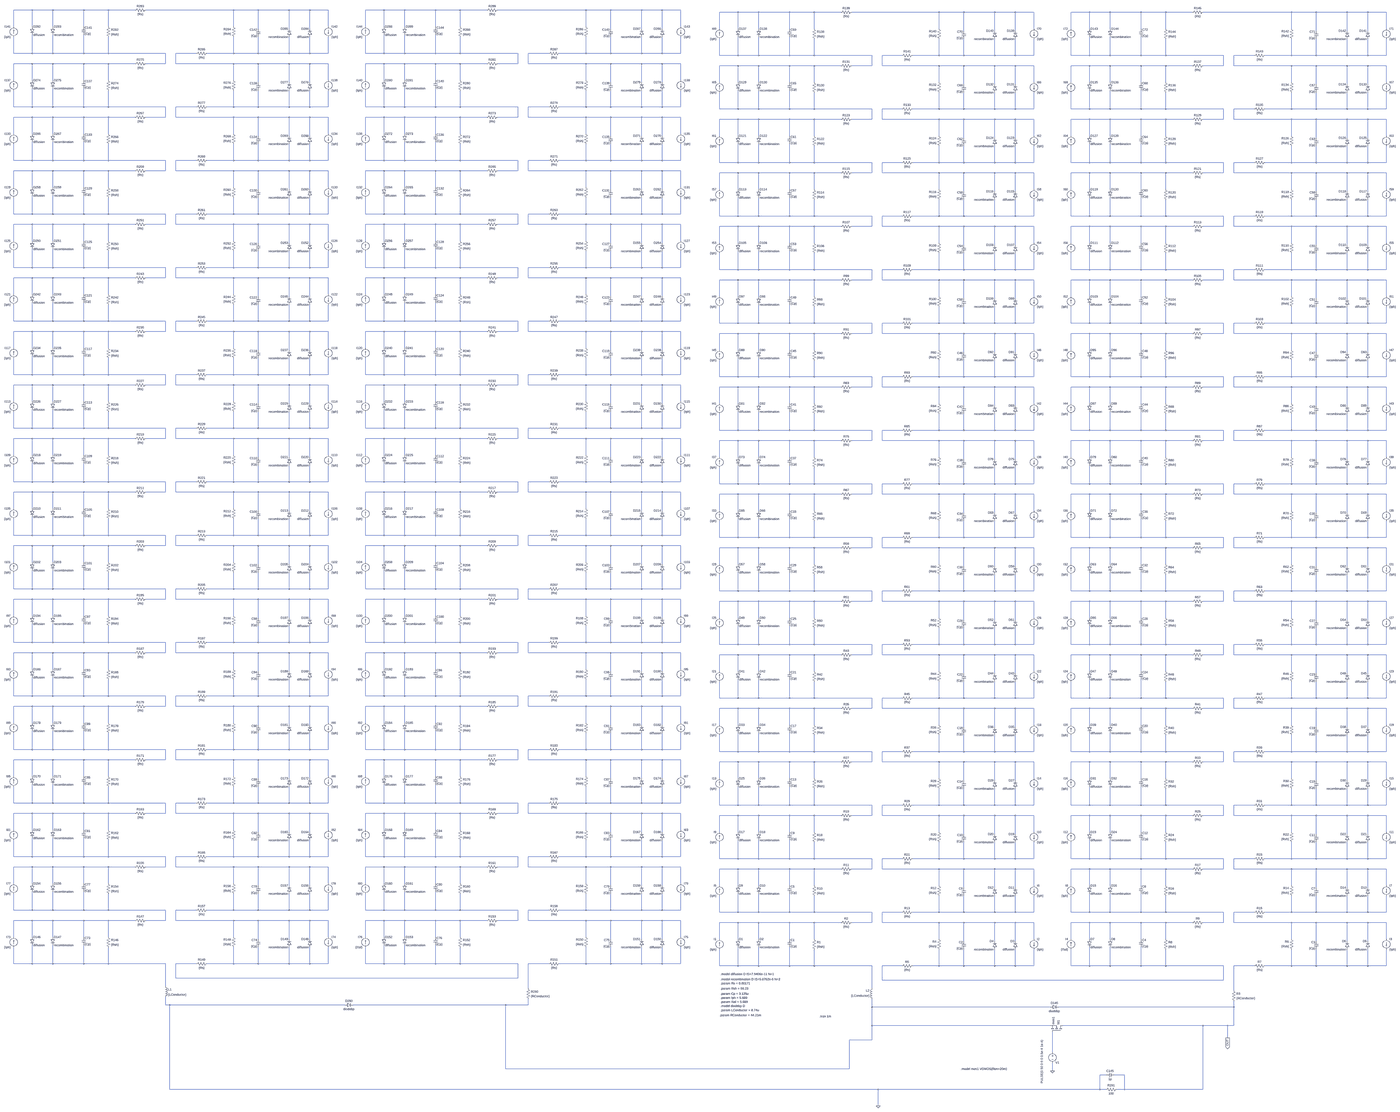
[diagram p0: schematic shortcircuit-cells.asc, whole sheet]
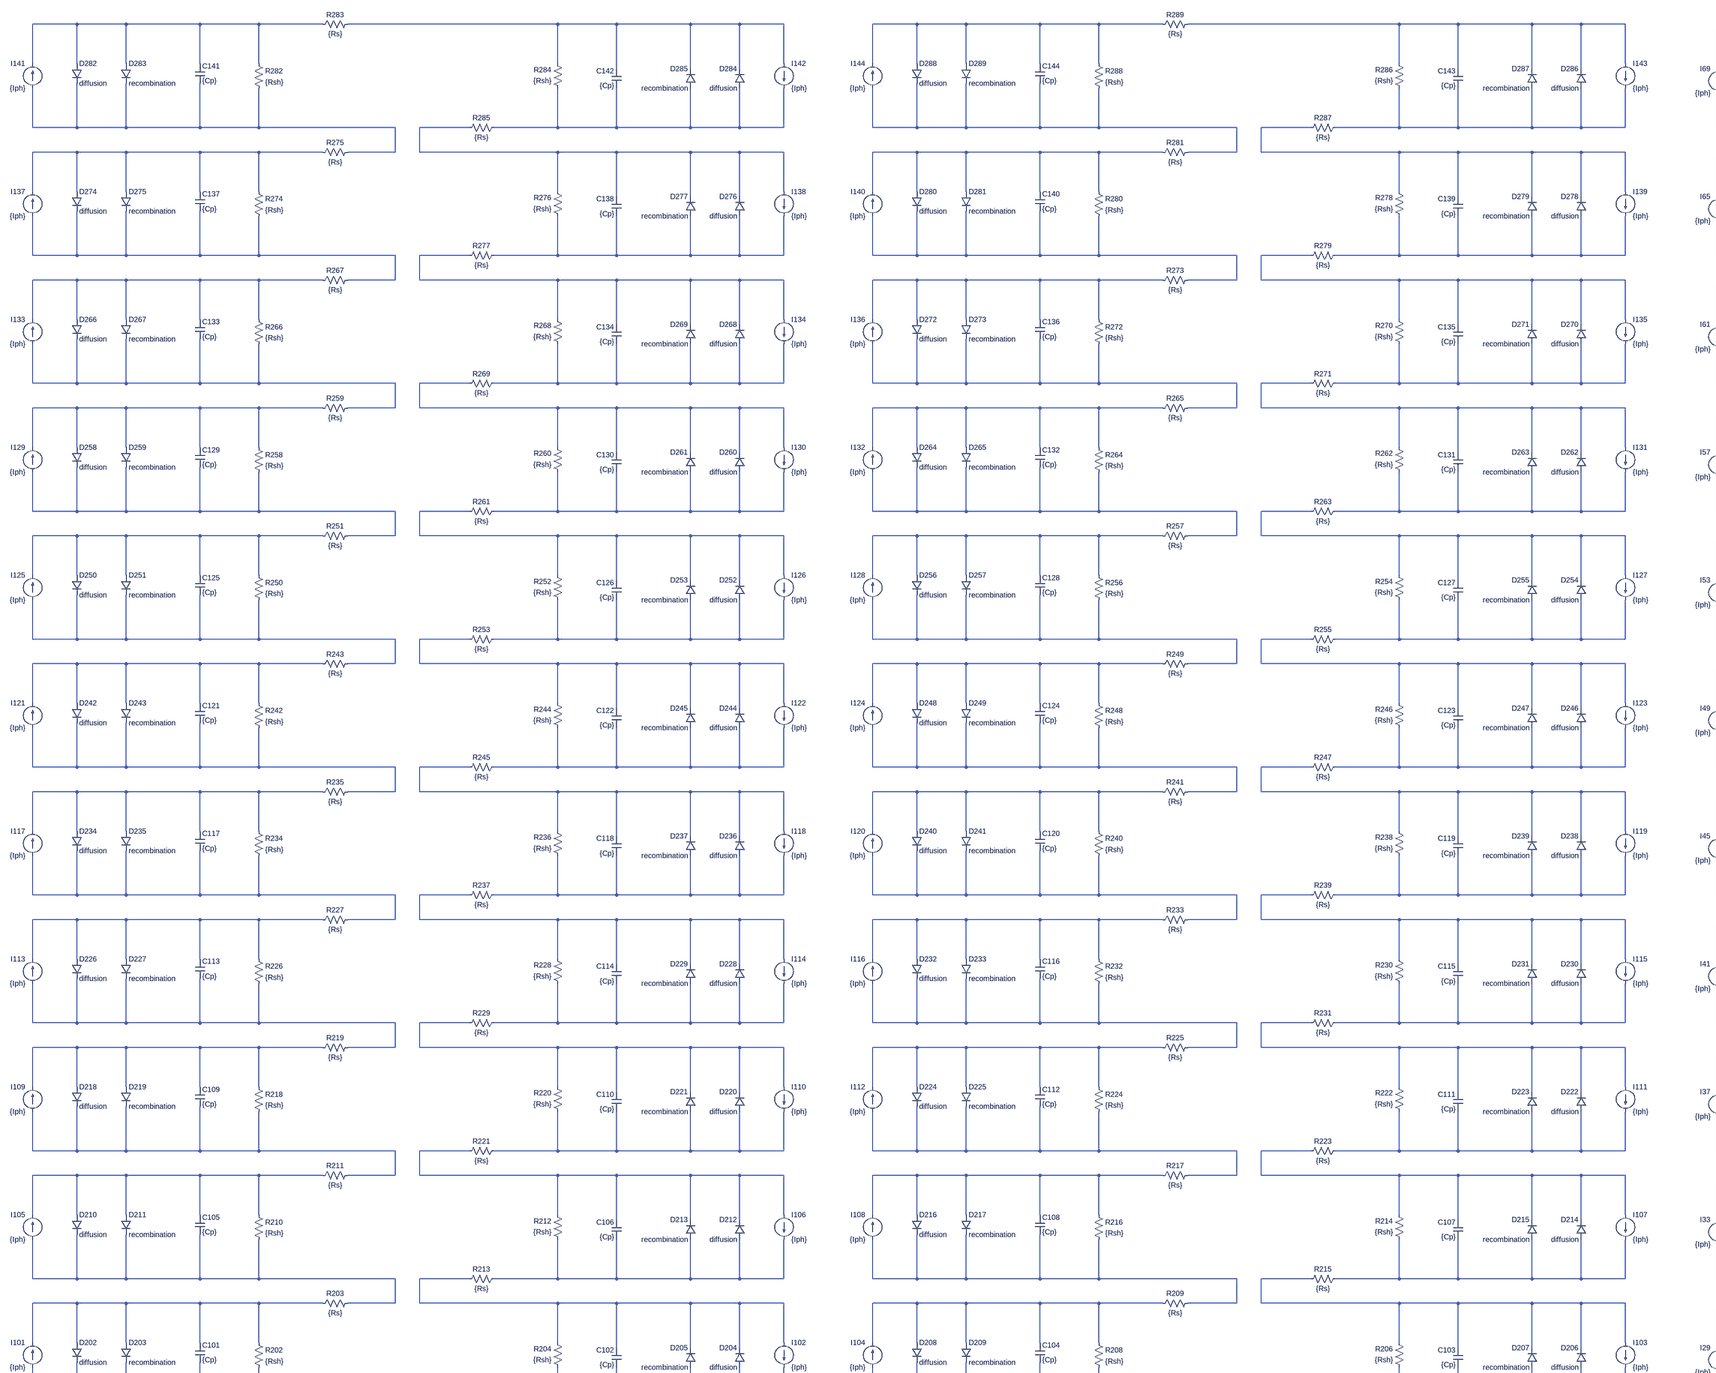
[diagram p1: schematic shortcircuit-cells.asc, part, row 1 of 2, column 1 of 2]
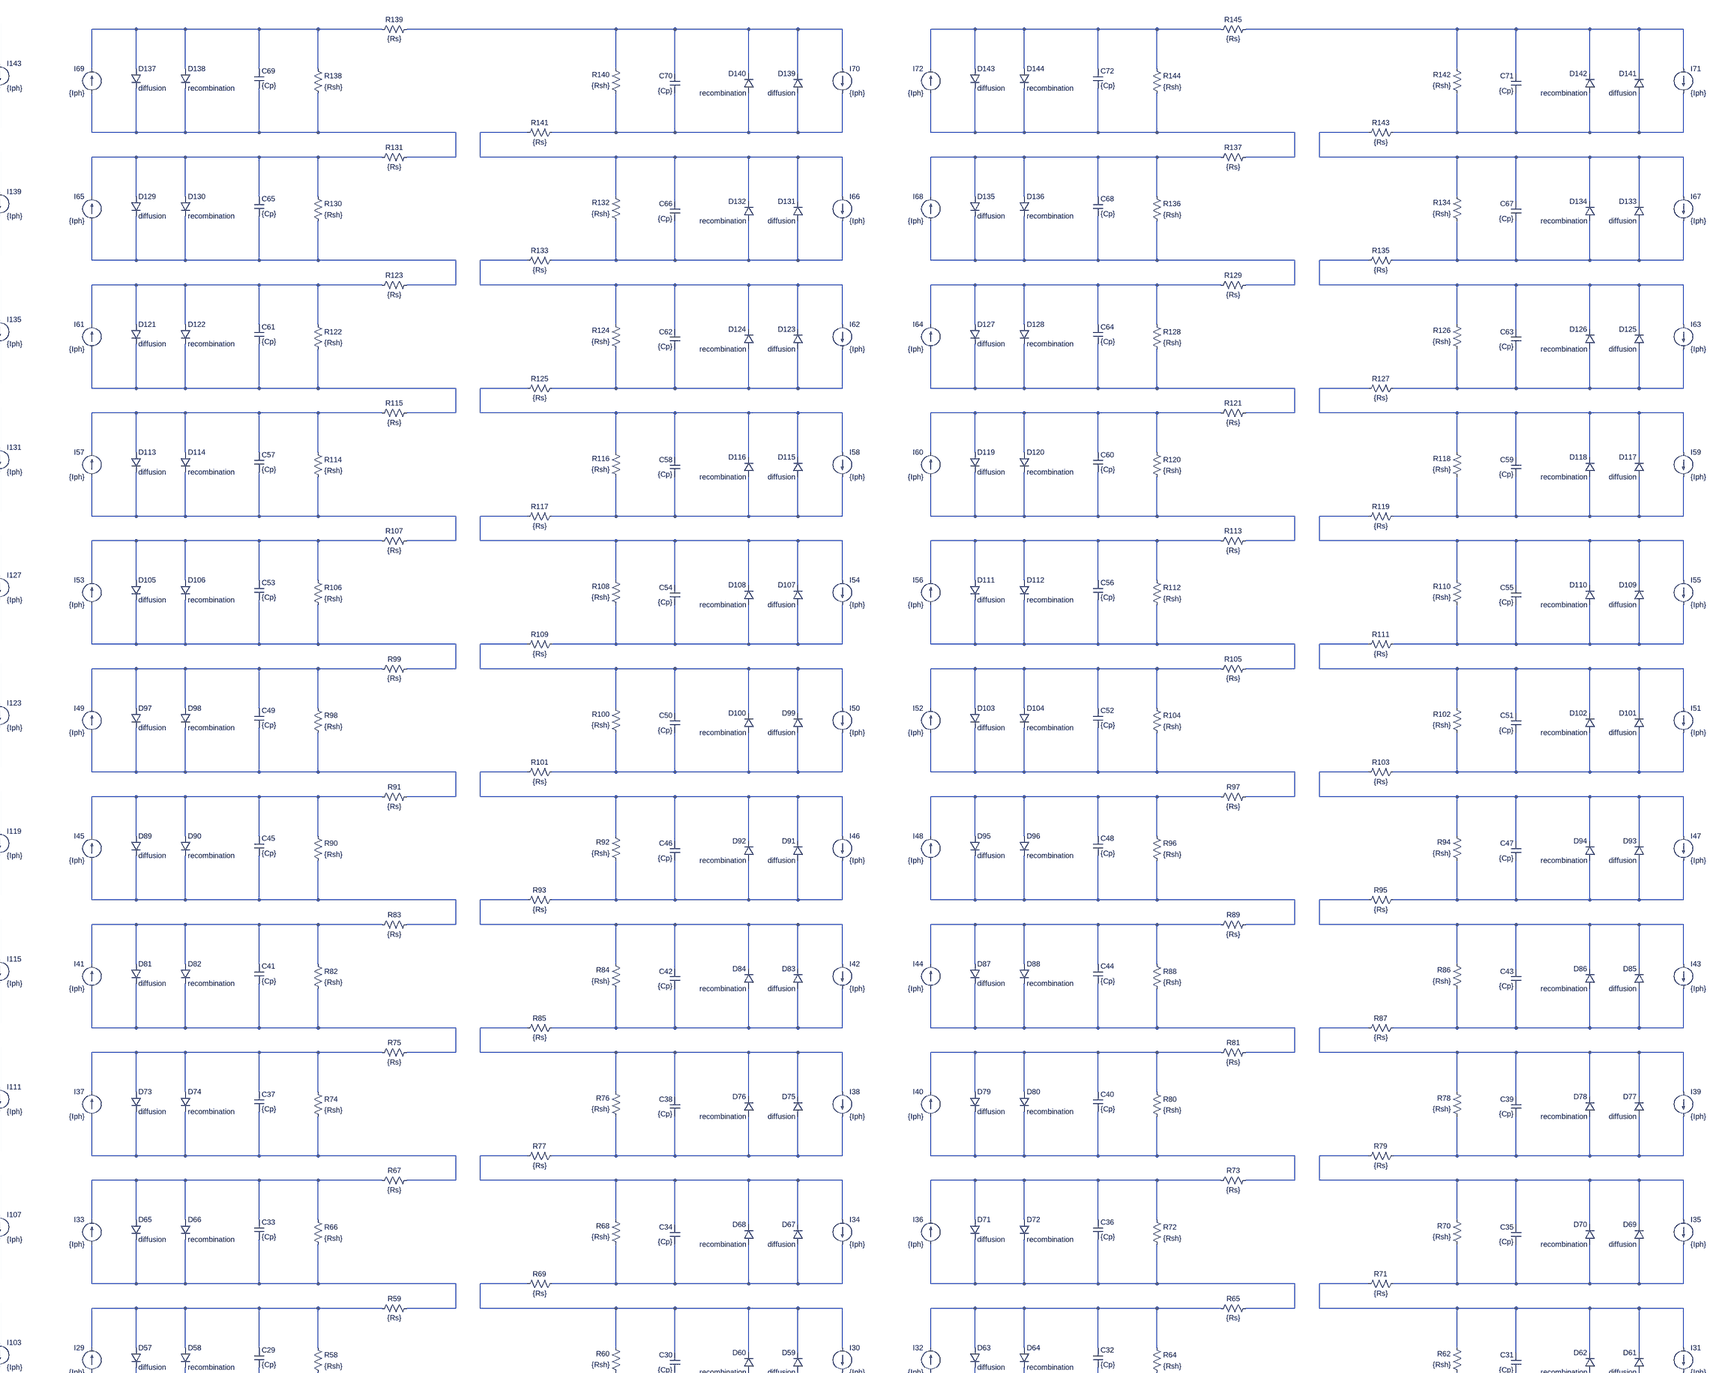
[diagram p2: schematic shortcircuit-cells.asc, part, row 1 of 2, column 2 of 2]
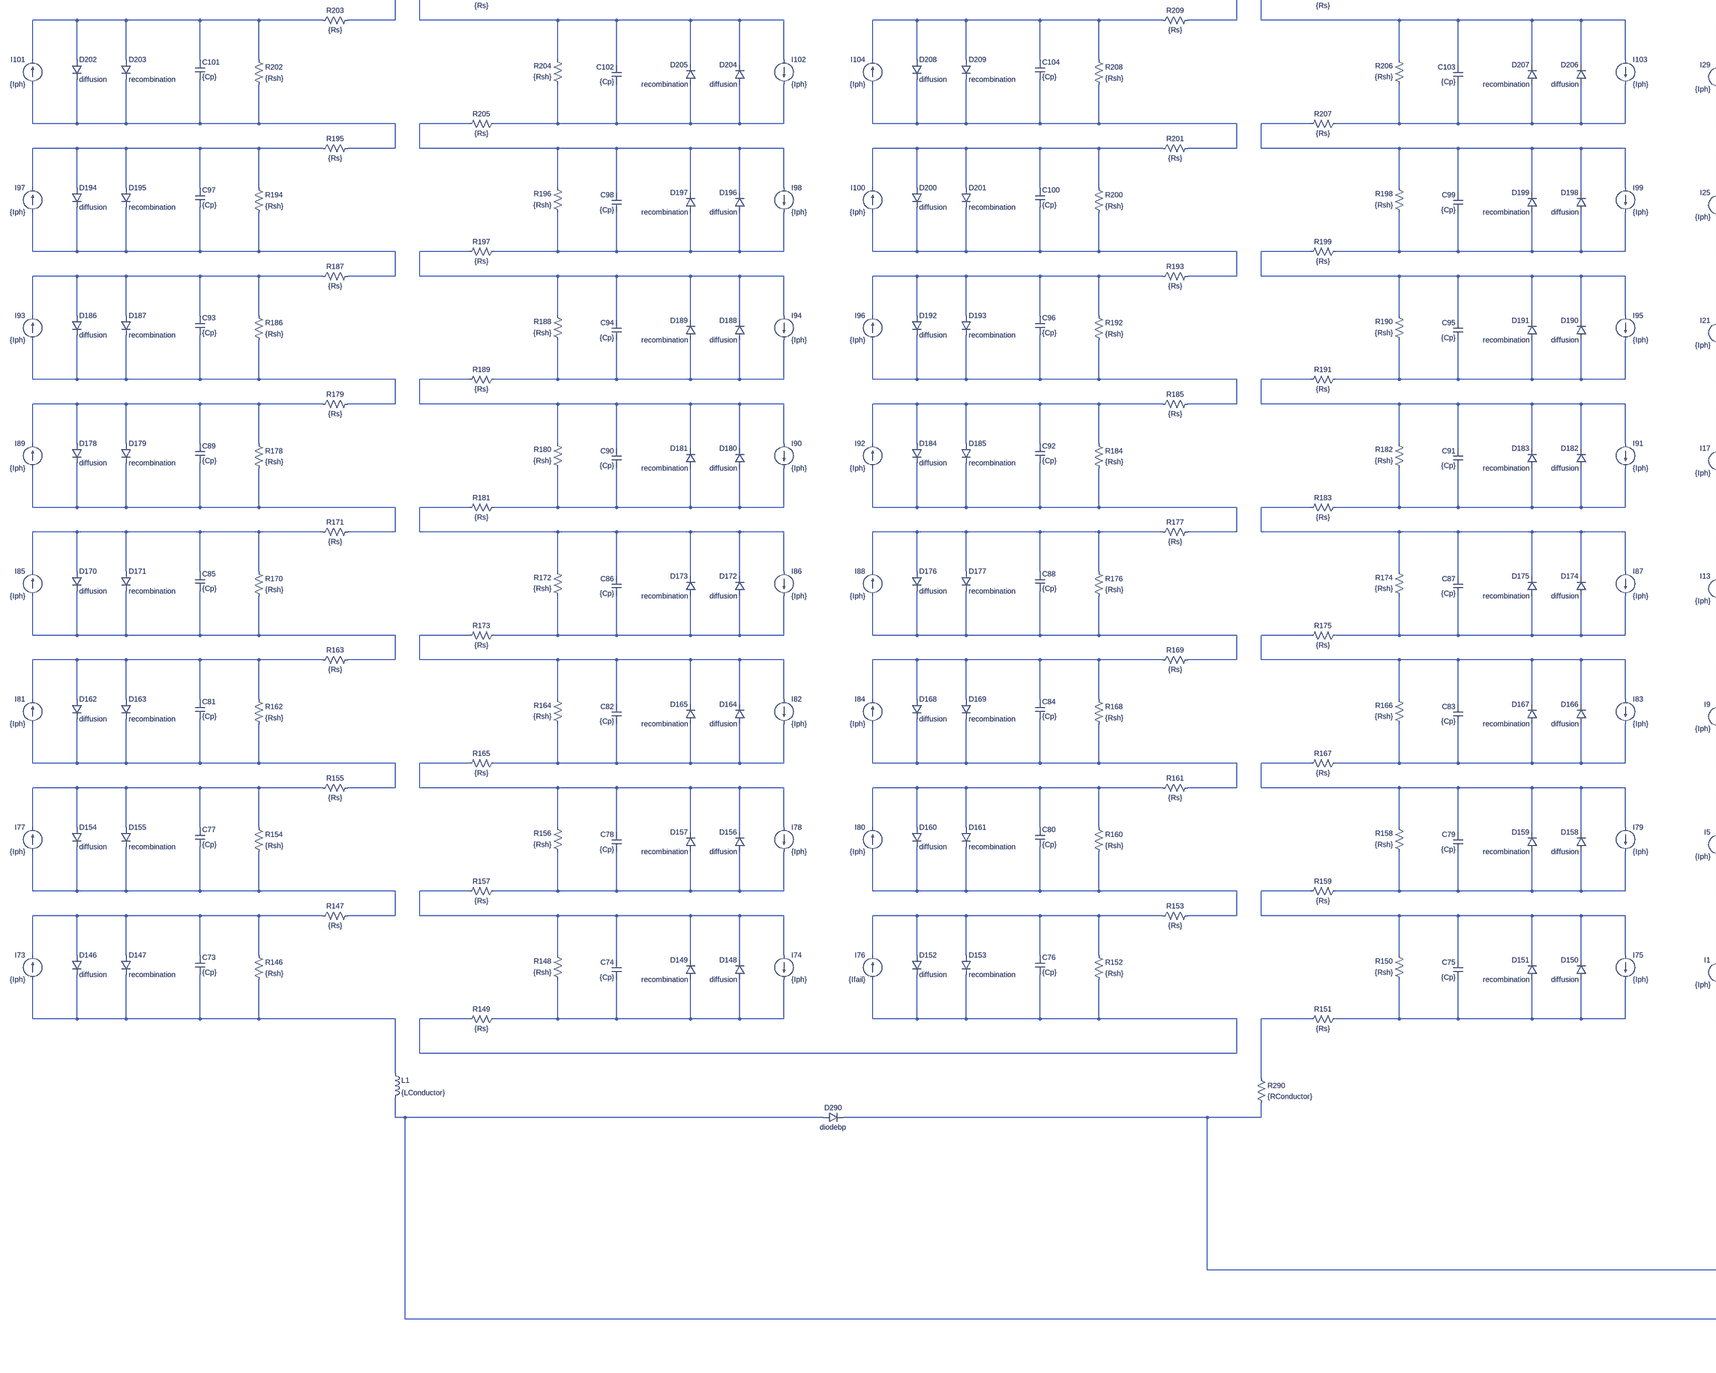
[diagram p3: schematic shortcircuit-cells.asc, part, row 2 of 2, column 1 of 2]
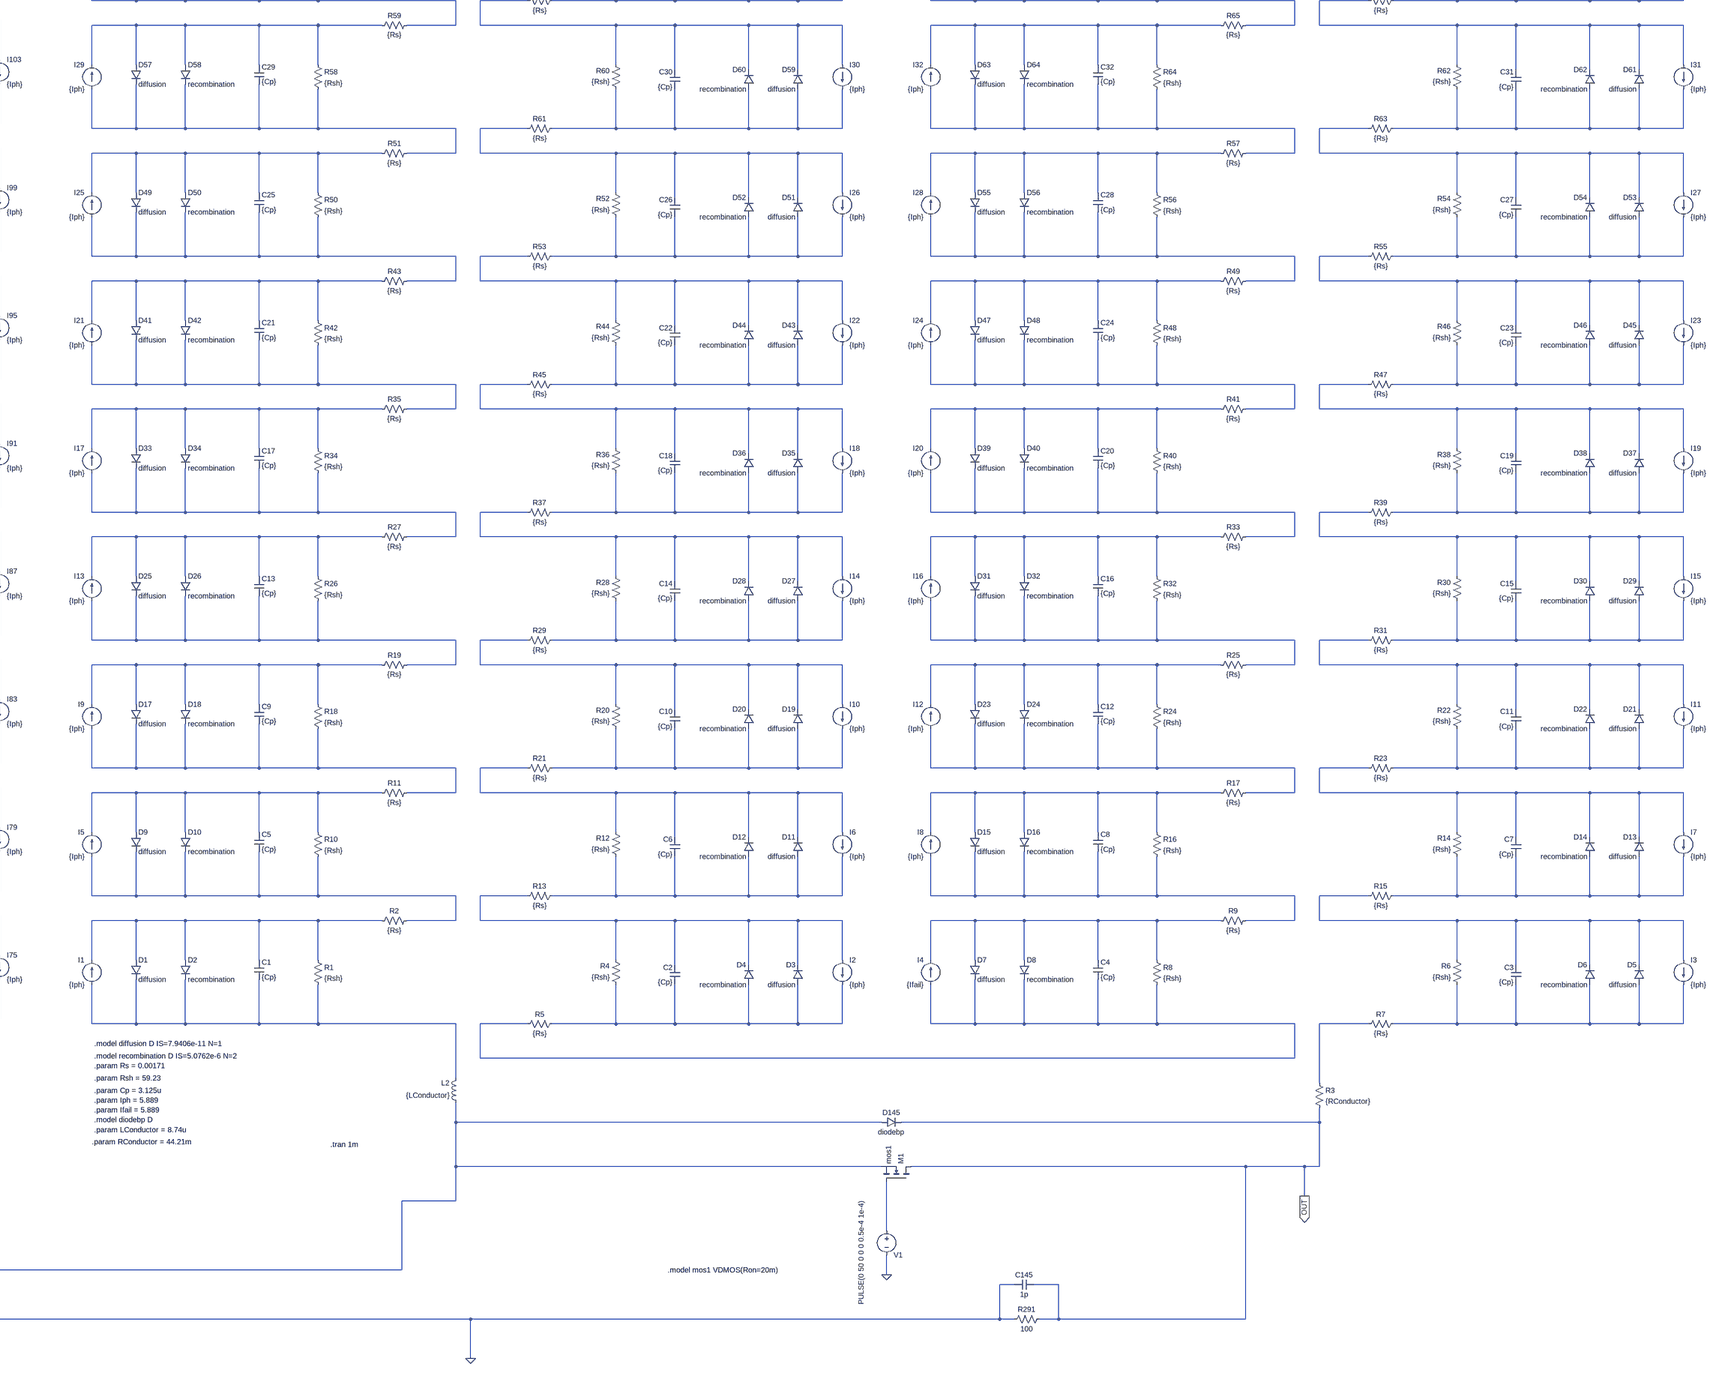
[diagram p4: schematic shortcircuit-cells.asc, part, row 2 of 2, column 2 of 2]
* shortcircuit-cells.asc
I1 N286 N279 {Iph}
D1 N279 N286 diffusion
D2 N279 N286 recombination
C1 N279 N286 {Cp}
R1 N279 N286 {Rsh}
R2 N279 N271 {Rs}
I2 N272 N288 {Iph}
D3 N288 N272 diffusion
D4 N288 N272 recombination
C2 N288 N272 {Cp}
R4 N288 N272 {Rsh}
R5 N288 N287 {Rs}
I3 N275 N290 {Iph}
D5 N290 N275 diffusion
D6 N290 N275 recombination
C3 N290 N275 {Cp}
R6 N290 N275 {Rsh}
R7 N290 N289 {Rs}
I4 N287 N280 {Ifail}
D7 N280 N287 diffusion
D8 N280 N287 recombination
C4 N280 N287 {Cp}
R8 N280 N287 {Rsh}
R9 N280 N274 {Rs}
I5 N271 N263 {Iph}
D9 N263 N271 diffusion
D10 N263 N271 recombination
C5 N263 N271 {Cp}
R10 N263 N271 {Rsh}
R11 N263 N255 {Rs}
I6 N256 N273 {Iph}
D11 N273 N256 diffusion
D12 N273 N256 recombination
C6 N273 N256 {Cp}
R12 N273 N256 {Rsh}
R13 N273 N272 {Rs}
I7 N259 N276 {Iph}
D13 N276 N259 diffusion
D14 N276 N259 recombination
C7 N276 N259 {Cp}
R14 N276 N259 {Rsh}
R15 N276 N275 {Rs}
I8 N274 N264 {Iph}
D15 N264 N274 diffusion
D16 N264 N274 recombination
C8 N264 N274 {Cp}
R16 N264 N274 {Rsh}
R17 N264 N258 {Rs}
I9 N255 N247 {Iph}
D17 N247 N255 diffusion
D18 N247 N255 recombination
C9 N247 N255 {Cp}
R18 N247 N255 {Rsh}
R19 N247 N239 {Rs}
I10 N240 N257 {Iph}
D19 N257 N240 diffusion
D20 N257 N240 recombination
C10 N257 N240 {Cp}
R20 N257 N240 {Rsh}
R21 N257 N256 {Rs}
I11 N243 N260 {Iph}
D21 N260 N243 diffusion
D22 N260 N243 recombination
C11 N260 N243 {Cp}
R22 N260 N243 {Rsh}
R23 N260 N259 {Rs}
I12 N258 N248 {Iph}
D23 N248 N258 diffusion
D24 N248 N258 recombination
C12 N248 N258 {Cp}
R24 N248 N258 {Rsh}
R25 N248 N242 {Rs}
I13 N239 N231 {Iph}
D25 N231 N239 diffusion
D26 N231 N239 recombination
C13 N231 N239 {Cp}
R26 N231 N239 {Rsh}
R27 N231 N223 {Rs}
I14 N224 N241 {Iph}
D27 N241 N224 diffusion
D28 N241 N224 recombination
C14 N241 N224 {Cp}
R28 N241 N224 {Rsh}
R29 N241 N240 {Rs}
I15 N227 N244 {Iph}
D29 N244 N227 diffusion
D30 N244 N227 recombination
C15 N244 N227 {Cp}
R30 N244 N227 {Rsh}
R31 N244 N243 {Rs}
I16 N242 N232 {Iph}
D31 N232 N242 diffusion
D32 N232 N242 recombination
C16 N232 N242 {Cp}
R32 N232 N242 {Rsh}
R33 N232 N226 {Rs}
I17 N223 N215 {Iph}
D33 N215 N223 diffusion
D34 N215 N223 recombination
C17 N215 N223 {Cp}
R34 N215 N223 {Rsh}
R35 N215 N207 {Rs}
I18 N208 N225 {Iph}
D35 N225 N208 diffusion
D36 N225 N208 recombination
C18 N225 N208 {Cp}
R36 N225 N208 {Rsh}
R37 N225 N224 {Rs}
I19 N211 N228 {Iph}
D37 N228 N211 diffusion
D38 N228 N211 recombination
C19 N228 N211 {Cp}
R38 N228 N211 {Rsh}
R39 N228 N227 {Rs}
I20 N226 N216 {Iph}
D39 N216 N226 diffusion
D40 N216 N226 recombination
C20 N216 N226 {Cp}
R40 N216 N226 {Rsh}
R41 N216 N210 {Rs}
I21 N207 N199 {Iph}
D41 N199 N207 diffusion
D42 N199 N207 recombination
C21 N199 N207 {Cp}
R42 N199 N207 {Rsh}
R43 N199 N191 {Rs}
I22 N192 N209 {Iph}
D43 N209 N192 diffusion
D44 N209 N192 recombination
C22 N209 N192 {Cp}
R44 N209 N192 {Rsh}
R45 N209 N208 {Rs}
I23 N195 N212 {Iph}
D45 N212 N195 diffusion
D46 N212 N195 recombination
C23 N212 N195 {Cp}
R46 N212 N195 {Rsh}
R47 N212 N211 {Rs}
I24 N210 N200 {Iph}
D47 N200 N210 diffusion
D48 N200 N210 recombination
C24 N200 N210 {Cp}
R48 N200 N210 {Rsh}
R49 N200 N194 {Rs}
I25 N191 N183 {Iph}
D49 N183 N191 diffusion
D50 N183 N191 recombination
C25 N183 N191 {Cp}
R50 N183 N191 {Rsh}
R51 N183 N175 {Rs}
I26 N176 N193 {Iph}
D51 N193 N176 diffusion
D52 N193 N176 recombination
C26 N193 N176 {Cp}
R52 N193 N176 {Rsh}
R53 N193 N192 {Rs}
I27 N179 N196 {Iph}
D53 N196 N179 diffusion
D54 N196 N179 recombination
C27 N196 N179 {Cp}
R54 N196 N179 {Rsh}
R55 N196 N195 {Rs}
I28 N194 N184 {Iph}
D55 N184 N194 diffusion
D56 N184 N194 recombination
C28 N184 N194 {Cp}
R56 N184 N194 {Rsh}
R57 N184 N178 {Rs}
I29 N175 N167 {Iph}
D57 N167 N175 diffusion
D58 N167 N175 recombination
C29 N167 N175 {Cp}
R58 N167 N175 {Rsh}
R59 N167 N159 {Rs}
I30 N160 N177 {Iph}
D59 N177 N160 diffusion
D60 N177 N160 recombination
C30 N177 N160 {Cp}
R60 N177 N160 {Rsh}
R61 N177 N176 {Rs}
I31 N163 N180 {Iph}
D61 N180 N163 diffusion
D62 N180 N163 recombination
C31 N180 N163 {Cp}
R62 N180 N163 {Rsh}
R63 N180 N179 {Rs}
I32 N178 N168 {Iph}
D63 N168 N178 diffusion
D64 N168 N178 recombination
C32 N168 N178 {Cp}
R64 N168 N178 {Rsh}
R65 N168 N162 {Rs}
I33 N159 N151 {Iph}
D65 N151 N159 diffusion
D66 N151 N159 recombination
C33 N151 N159 {Cp}
R66 N151 N159 {Rsh}
R67 N151 N143 {Rs}
I34 N144 N161 {Iph}
D67 N161 N144 diffusion
D68 N161 N144 recombination
C34 N161 N144 {Cp}
R68 N161 N144 {Rsh}
R69 N161 N160 {Rs}
I35 N147 N164 {Iph}
D69 N164 N147 diffusion
D70 N164 N147 recombination
C35 N164 N147 {Cp}
R70 N164 N147 {Rsh}
R71 N164 N163 {Rs}
I36 N162 N152 {Iph}
D71 N152 N162 diffusion
D72 N152 N162 recombination
C36 N152 N162 {Cp}
R72 N152 N162 {Rsh}
R73 N152 N146 {Rs}
I37 N143 N135 {Iph}
D73 N135 N143 diffusion
D74 N135 N143 recombination
C37 N135 N143 {Cp}
R74 N135 N143 {Rsh}
R75 N135 N127 {Rs}
I38 N128 N145 {Iph}
D75 N145 N128 diffusion
D76 N145 N128 recombination
C38 N145 N128 {Cp}
R76 N145 N128 {Rsh}
R77 N145 N144 {Rs}
I39 N131 N148 {Iph}
D77 N148 N131 diffusion
D78 N148 N131 recombination
C39 N148 N131 {Cp}
R78 N148 N131 {Rsh}
R79 N148 N147 {Rs}
I40 N146 N136 {Iph}
D79 N136 N146 diffusion
D80 N136 N146 recombination
C40 N136 N146 {Cp}
R80 N136 N146 {Rsh}
R81 N136 N130 {Rs}
I41 N127 N119 {Iph}
D81 N119 N127 diffusion
D82 N119 N127 recombination
C41 N119 N127 {Cp}
R82 N119 N127 {Rsh}
R83 N119 N111 {Rs}
I42 N112 N129 {Iph}
D83 N129 N112 diffusion
D84 N129 N112 recombination
C42 N129 N112 {Cp}
R84 N129 N112 {Rsh}
R85 N129 N128 {Rs}
I43 N115 N132 {Iph}
D85 N132 N115 diffusion
D86 N132 N115 recombination
C43 N132 N115 {Cp}
R86 N132 N115 {Rsh}
R87 N132 N131 {Rs}
I44 N130 N120 {Iph}
D87 N120 N130 diffusion
D88 N120 N130 recombination
C44 N120 N130 {Cp}
R88 N120 N130 {Rsh}
R89 N120 N114 {Rs}
I45 N111 N103 {Iph}
D89 N103 N111 diffusion
D90 N103 N111 recombination
C45 N103 N111 {Cp}
R90 N103 N111 {Rsh}
R91 N103 N095 {Rs}
I46 N096 N113 {Iph}
D91 N113 N096 diffusion
D92 N113 N096 recombination
C46 N113 N096 {Cp}
R92 N113 N096 {Rsh}
R93 N113 N112 {Rs}
I47 N099 N116 {Iph}
D93 N116 N099 diffusion
D94 N116 N099 recombination
C47 N116 N099 {Cp}
R94 N116 N099 {Rsh}
R95 N116 N115 {Rs}
I48 N114 N104 {Iph}
D95 N104 N114 diffusion
D96 N104 N114 recombination
C48 N104 N114 {Cp}
R96 N104 N114 {Rsh}
R97 N104 N098 {Rs}
I49 N095 N087 {Iph}
D97 N087 N095 diffusion
D98 N087 N095 recombination
C49 N087 N095 {Cp}
R98 N087 N095 {Rsh}
R99 N087 N079 {Rs}
I50 N080 N097 {Iph}
D99 N097 N080 diffusion
D100 N097 N080 recombination
C50 N097 N080 {Cp}
R100 N097 N080 {Rsh}
R101 N097 N096 {Rs}
I51 N083 N100 {Iph}
D101 N100 N083 diffusion
D102 N100 N083 recombination
C51 N100 N083 {Cp}
R102 N100 N083 {Rsh}
R103 N100 N099 {Rs}
I52 N098 N088 {Iph}
D103 N088 N098 diffusion
D104 N088 N098 recombination
C52 N088 N098 {Cp}
R104 N088 N098 {Rsh}
R105 N088 N082 {Rs}
I53 N079 N071 {Iph}
D105 N071 N079 diffusion
D106 N071 N079 recombination
C53 N071 N079 {Cp}
R106 N071 N079 {Rsh}
R107 N071 N063 {Rs}
I54 N064 N081 {Iph}
D107 N081 N064 diffusion
D108 N081 N064 recombination
C54 N081 N064 {Cp}
R108 N081 N064 {Rsh}
R109 N081 N080 {Rs}
I55 N067 N084 {Iph}
D109 N084 N067 diffusion
D110 N084 N067 recombination
C55 N084 N067 {Cp}
R110 N084 N067 {Rsh}
R111 N084 N083 {Rs}
I56 N082 N072 {Iph}
D111 N072 N082 diffusion
D112 N072 N082 recombination
C56 N072 N082 {Cp}
R112 N072 N082 {Rsh}
R113 N072 N066 {Rs}
I57 N063 N055 {Iph}
D113 N055 N063 diffusion
D114 N055 N063 recombination
C57 N055 N063 {Cp}
R114 N055 N063 {Rsh}
R115 N055 N047 {Rs}
I58 N048 N065 {Iph}
D115 N065 N048 diffusion
D116 N065 N048 recombination
C58 N065 N048 {Cp}
R116 N065 N048 {Rsh}
R117 N065 N064 {Rs}
I59 N051 N068 {Iph}
D117 N068 N051 diffusion
D118 N068 N051 recombination
C59 N068 N051 {Cp}
R118 N068 N051 {Rsh}
R119 N068 N067 {Rs}
I60 N066 N056 {Iph}
D119 N056 N066 diffusion
D120 N056 N066 recombination
C60 N056 N066 {Cp}
R120 N056 N066 {Rsh}
R121 N056 N050 {Rs}
I61 N047 N039 {Iph}
D121 N039 N047 diffusion
D122 N039 N047 recombination
C61 N039 N047 {Cp}
R122 N039 N047 {Rsh}
R123 N039 N031 {Rs}
I62 N032 N049 {Iph}
D123 N049 N032 diffusion
D124 N049 N032 recombination
C62 N049 N032 {Cp}
R124 N049 N032 {Rsh}
R125 N049 N048 {Rs}
I63 N035 N052 {Iph}
D125 N052 N035 diffusion
D126 N052 N035 recombination
C63 N052 N035 {Cp}
R126 N052 N035 {Rsh}
R127 N052 N051 {Rs}
I64 N050 N040 {Iph}
D127 N040 N050 diffusion
D128 N040 N050 recombination
C64 N040 N050 {Cp}
R128 N040 N050 {Rsh}
R129 N040 N034 {Rs}
I65 N031 N023 {Iph}
D129 N023 N031 diffusion
D130 N023 N031 recombination
C65 N023 N031 {Cp}
R130 N023 N031 {Rsh}
R131 N023 N015 {Rs}
I66 N016 N033 {Iph}
D131 N033 N016 diffusion
D132 N033 N016 recombination
C66 N033 N016 {Cp}
R132 N033 N016 {Rsh}
R133 N033 N032 {Rs}
I67 N019 N036 {Iph}
D133 N036 N019 diffusion
D134 N036 N019 recombination
C67 N036 N019 {Cp}
R134 N036 N019 {Rsh}
R135 N036 N035 {Rs}
I68 N034 N024 {Iph}
D135 N024 N034 diffusion
D136 N024 N034 recombination
C68 N024 N034 {Cp}
R136 N024 N034 {Rsh}
R137 N024 N018 {Rs}
I69 N015 N005 {Iph}
D137 N005 N015 diffusion
D138 N005 N015 recombination
C69 N005 N015 {Cp}
R138 N005 N015 {Rsh}
R139 N005 N006 {Rs}
I70 N006 N017 {Iph}
D139 N017 N006 diffusion
D140 N017 N006 recombination
C70 N017 N006 {Cp}
R140 N017 N006 {Rsh}
R141 N017 N016 {Rs}
I71 N008 N020 {Iph}
D141 N020 N008 diffusion
D142 N020 N008 recombination
C71 N020 N008 {Cp}
R142 N020 N008 {Rsh}
R143 N020 N019 {Rs}
I72 N018 N007 {Iph}
D143 N007 N018 diffusion
D144 N007 N018 recombination
C72 N007 N018 {Cp}
R144 N007 N018 {Rsh}
R145 N007 N008 {Rs}
D145 N291 OUT diodebp
L2 N291 N286 {LConductor}
R3 N289 OUT {RConductor}
M1 OUT N292 N291 N291 mos1
V1 N292 0 PULSE(0 50 0 0 0 0.5e-4 1e-4)
I73 N281 N277 {Iph}
D146 N277 N281 diffusion
D147 N277 N281 recombination
C73 N277 N281 {Cp}
R146 N277 N281 {Rsh}
R147 N277 N265 {Rs}
I74 N266 N283 {Iph}
D148 N283 N266 diffusion
D149 N283 N266 recombination
C74 N283 N266 {Cp}
R148 N283 N266 {Rsh}
R149 N283 N282 {Rs}
I75 N269 N285 {Iph}
D150 N285 N269 diffusion
D151 N285 N269 recombination
C75 N285 N269 {Cp}
R150 N285 N269 {Rsh}
R151 N285 N284 {Rs}
I76 N282 N278 {Ifail}
D152 N278 N282 diffusion
D153 N278 N282 recombination
C76 N278 N282 {Cp}
R152 N278 N282 {Rsh}
R153 N278 N268 {Rs}
I77 N265 N261 {Iph}
D154 N261 N265 diffusion
D155 N261 N265 recombination
C77 N261 N265 {Cp}
R154 N261 N265 {Rsh}
R155 N261 N249 {Rs}
I78 N250 N267 {Iph}
D156 N267 N250 diffusion
D157 N267 N250 recombination
C78 N267 N250 {Cp}
R156 N267 N250 {Rsh}
R157 N267 N266 {Rs}
I79 N253 N270 {Iph}
D158 N270 N253 diffusion
D159 N270 N253 recombination
C79 N270 N253 {Cp}
R158 N270 N253 {Rsh}
R159 N270 N269 {Rs}
I80 N268 N262 {Iph}
D160 N262 N268 diffusion
D161 N262 N268 recombination
C80 N262 N268 {Cp}
R160 N262 N268 {Rsh}
R161 N262 N252 {Rs}
I81 N249 N245 {Iph}
D162 N245 N249 diffusion
D163 N245 N249 recombination
C81 N245 N249 {Cp}
R162 N245 N249 {Rsh}
R163 N245 N233 {Rs}
I82 N234 N251 {Iph}
D164 N251 N234 diffusion
D165 N251 N234 recombination
C82 N251 N234 {Cp}
R164 N251 N234 {Rsh}
R165 N251 N250 {Rs}
I83 N237 N254 {Iph}
D166 N254 N237 diffusion
D167 N254 N237 recombination
C83 N254 N237 {Cp}
R166 N254 N237 {Rsh}
R167 N254 N253 {Rs}
I84 N252 N246 {Iph}
D168 N246 N252 diffusion
D169 N246 N252 recombination
C84 N246 N252 {Cp}
R168 N246 N252 {Rsh}
R169 N246 N236 {Rs}
I85 N233 N229 {Iph}
D170 N229 N233 diffusion
D171 N229 N233 recombination
C85 N229 N233 {Cp}
R170 N229 N233 {Rsh}
R171 N229 N217 {Rs}
I86 N218 N235 {Iph}
D172 N235 N218 diffusion
D173 N235 N218 recombination
C86 N235 N218 {Cp}
R172 N235 N218 {Rsh}
R173 N235 N234 {Rs}
I87 N221 N238 {Iph}
D174 N238 N221 diffusion
D175 N238 N221 recombination
C87 N238 N221 {Cp}
R174 N238 N221 {Rsh}
R175 N238 N237 {Rs}
I88 N236 N230 {Iph}
D176 N230 N236 diffusion
D177 N230 N236 recombination
C88 N230 N236 {Cp}
R176 N230 N236 {Rsh}
R177 N230 N220 {Rs}
I89 N217 N213 {Iph}
D178 N213 N217 diffusion
D179 N213 N217 recombination
C89 N213 N217 {Cp}
R178 N213 N217 {Rsh}
R179 N213 N201 {Rs}
I90 N202 N219 {Iph}
D180 N219 N202 diffusion
D181 N219 N202 recombination
C90 N219 N202 {Cp}
R180 N219 N202 {Rsh}
R181 N219 N218 {Rs}
I91 N205 N222 {Iph}
D182 N222 N205 diffusion
D183 N222 N205 recombination
C91 N222 N205 {Cp}
R182 N222 N205 {Rsh}
R183 N222 N221 {Rs}
I92 N220 N214 {Iph}
D184 N214 N220 diffusion
D185 N214 N220 recombination
C92 N214 N220 {Cp}
R184 N214 N220 {Rsh}
R185 N214 N204 {Rs}
I93 N201 N197 {Iph}
D186 N197 N201 diffusion
D187 N197 N201 recombination
C93 N197 N201 {Cp}
R186 N197 N201 {Rsh}
R187 N197 N185 {Rs}
I94 N186 N203 {Iph}
D188 N203 N186 diffusion
D189 N203 N186 recombination
C94 N203 N186 {Cp}
R188 N203 N186 {Rsh}
R189 N203 N202 {Rs}
I95 N189 N206 {Iph}
D190 N206 N189 diffusion
D191 N206 N189 recombination
C95 N206 N189 {Cp}
R190 N206 N189 {Rsh}
R191 N206 N205 {Rs}
I96 N204 N198 {Iph}
D192 N198 N204 diffusion
D193 N198 N204 recombination
C96 N198 N204 {Cp}
R192 N198 N204 {Rsh}
R193 N198 N188 {Rs}
I97 N185 N181 {Iph}
D194 N181 N185 diffusion
D195 N181 N185 recombination
C97 N181 N185 {Cp}
R194 N181 N185 {Rsh}
R195 N181 N169 {Rs}
I98 N170 N187 {Iph}
D196 N187 N170 diffusion
D197 N187 N170 recombination
C98 N187 N170 {Cp}
R196 N187 N170 {Rsh}
R197 N187 N186 {Rs}
I99 N173 N190 {Iph}
D198 N190 N173 diffusion
D199 N190 N173 recombination
C99 N190 N173 {Cp}
R198 N190 N173 {Rsh}
R199 N190 N189 {Rs}
I100 N188 N182 {Iph}
D200 N182 N188 diffusion
D201 N182 N188 recombination
C100 N182 N188 {Cp}
R200 N182 N188 {Rsh}
R201 N182 N172 {Rs}
I101 N169 N165 {Iph}
D202 N165 N169 diffusion
D203 N165 N169 recombination
C101 N165 N169 {Cp}
R202 N165 N169 {Rsh}
R203 N165 N153 {Rs}
I102 N154 N171 {Iph}
D204 N171 N154 diffusion
D205 N171 N154 recombination
C102 N171 N154 {Cp}
R204 N171 N154 {Rsh}
R205 N171 N170 {Rs}
I103 N157 N174 {Iph}
D206 N174 N157 diffusion
D207 N174 N157 recombination
C103 N174 N157 {Cp}
R206 N174 N157 {Rsh}
R207 N174 N173 {Rs}
I104 N172 N166 {Iph}
D208 N166 N172 diffusion
D209 N166 N172 recombination
C104 N166 N172 {Cp}
R208 N166 N172 {Rsh}
R209 N166 N156 {Rs}
I105 N153 N149 {Iph}
D210 N149 N153 diffusion
D211 N149 N153 recombination
C105 N149 N153 {Cp}
R210 N149 N153 {Rsh}
R211 N149 N137 {Rs}
I106 N138 N155 {Iph}
D212 N155 N138 diffusion
D213 N155 N138 recombination
C106 N155 N138 {Cp}
R212 N155 N138 {Rsh}
R213 N155 N154 {Rs}
I107 N141 N158 {Iph}
D214 N158 N141 diffusion
D215 N158 N141 recombination
C107 N158 N141 {Cp}
R214 N158 N141 {Rsh}
R215 N158 N157 {Rs}
I108 N156 N150 {Iph}
D216 N150 N156 diffusion
D217 N150 N156 recombination
C108 N150 N156 {Cp}
R216 N150 N156 {Rsh}
R217 N150 N140 {Rs}
I109 N137 N133 {Iph}
D218 N133 N137 diffusion
D219 N133 N137 recombination
C109 N133 N137 {Cp}
R218 N133 N137 {Rsh}
R219 N133 N121 {Rs}
I110 N122 N139 {Iph}
D220 N139 N122 diffusion
D221 N139 N122 recombination
C110 N139 N122 {Cp}
R220 N139 N122 {Rsh}
R221 N139 N138 {Rs}
I111 N125 N142 {Iph}
D222 N142 N125 diffusion
D223 N142 N125 recombination
C111 N142 N125 {Cp}
R222 N142 N125 {Rsh}
R223 N142 N141 {Rs}
I112 N140 N134 {Iph}
D224 N134 N140 diffusion
D225 N134 N140 recombination
C112 N134 N140 {Cp}
R224 N134 N140 {Rsh}
R225 N134 N124 {Rs}
I113 N121 N117 {Iph}
D226 N117 N121 diffusion
D227 N117 N121 recombination
C113 N117 N121 {Cp}
R226 N117 N121 {Rsh}
R227 N117 N105 {Rs}
I114 N106 N123 {Iph}
D228 N123 N106 diffusion
D229 N123 N106 recombination
C114 N123 N106 {Cp}
R228 N123 N106 {Rsh}
R229 N123 N122 {Rs}
I115 N109 N126 {Iph}
D230 N126 N109 diffusion
D231 N126 N109 recombination
C115 N126 N109 {Cp}
R230 N126 N109 {Rsh}
R231 N126 N125 {Rs}
I116 N124 N118 {Iph}
D232 N118 N124 diffusion
D233 N118 N124 recombination
C116 N118 N124 {Cp}
R232 N118 N124 {Rsh}
R233 N118 N108 {Rs}
I117 N105 N101 {Iph}
D234 N101 N105 diffusion
D235 N101 N105 recombination
C117 N101 N105 {Cp}
R234 N101 N105 {Rsh}
R235 N101 N089 {Rs}
I118 N090 N107 {Iph}
D236 N107 N090 diffusion
D237 N107 N090 recombination
C118 N107 N090 {Cp}
R236 N107 N090 {Rsh}
R237 N107 N106 {Rs}
I119 N093 N110 {Iph}
D238 N110 N093 diffusion
D239 N110 N093 recombination
C119 N110 N093 {Cp}
R238 N110 N093 {Rsh}
R239 N110 N109 {Rs}
I120 N108 N102 {Iph}
D240 N102 N108 diffusion
D241 N102 N108 recombination
C120 N102 N108 {Cp}
R240 N102 N108 {Rsh}
R241 N102 N092 {Rs}
I121 N089 N085 {Iph}
D242 N085 N089 diffusion
D243 N085 N089 recombination
C121 N085 N089 {Cp}
R242 N085 N089 {Rsh}
R243 N085 N073 {Rs}
I122 N074 N091 {Iph}
D244 N091 N074 diffusion
D245 N091 N074 recombination
C122 N091 N074 {Cp}
R244 N091 N074 {Rsh}
R245 N091 N090 {Rs}
I123 N077 N094 {Iph}
D246 N094 N077 diffusion
D247 N094 N077 recombination
C123 N094 N077 {Cp}
R246 N094 N077 {Rsh}
R247 N094 N093 {Rs}
I124 N092 N086 {Iph}
D248 N086 N092 diffusion
D249 N086 N092 recombination
C124 N086 N092 {Cp}
R248 N086 N092 {Rsh}
R249 N086 N076 {Rs}
I125 N073 N069 {Iph}
D250 N069 N073 diffusion
D251 N069 N073 recombination
C125 N069 N073 {Cp}
R250 N069 N073 {Rsh}
R251 N069 N057 {Rs}
I126 N058 N075 {Iph}
D252 N075 N058 diffusion
D253 N075 N058 recombination
C126 N075 N058 {Cp}
R252 N075 N058 {Rsh}
R253 N075 N074 {Rs}
I127 N061 N078 {Iph}
D254 N078 N061 diffusion
D255 N078 N061 recombination
C127 N078 N061 {Cp}
R254 N078 N061 {Rsh}
R255 N078 N077 {Rs}
I128 N076 N070 {Iph}
D256 N070 N076 diffusion
D257 N070 N076 recombination
C128 N070 N076 {Cp}
R256 N070 N076 {Rsh}
R257 N070 N060 {Rs}
I129 N057 N053 {Iph}
D258 N053 N057 diffusion
D259 N053 N057 recombination
C129 N053 N057 {Cp}
R258 N053 N057 {Rsh}
R259 N053 N041 {Rs}
I130 N042 N059 {Iph}
D260 N059 N042 diffusion
D261 N059 N042 recombination
C130 N059 N042 {Cp}
R260 N059 N042 {Rsh}
R261 N059 N058 {Rs}
I131 N045 N062 {Iph}
D262 N062 N045 diffusion
D263 N062 N045 recombination
C131 N062 N045 {Cp}
R262 N062 N045 {Rsh}
R263 N062 N061 {Rs}
I132 N060 N054 {Iph}
D264 N054 N060 diffusion
D265 N054 N060 recombination
C132 N054 N060 {Cp}
R264 N054 N060 {Rsh}
R265 N054 N044 {Rs}
I133 N041 N037 {Iph}
D266 N037 N041 diffusion
D267 N037 N041 recombination
C133 N037 N041 {Cp}
R266 N037 N041 {Rsh}
R267 N037 N025 {Rs}
I134 N026 N043 {Iph}
D268 N043 N026 diffusion
D269 N043 N026 recombination
C134 N043 N026 {Cp}
R268 N043 N026 {Rsh}
R269 N043 N042 {Rs}
I135 N029 N046 {Iph}
D270 N046 N029 diffusion
D271 N046 N029 recombination
C135 N046 N029 {Cp}
R270 N046 N029 {Rsh}
R271 N046 N045 {Rs}
I136 N044 N038 {Iph}
D272 N038 N044 diffusion
D273 N038 N044 recombination
C136 N038 N044 {Cp}
R272 N038 N044 {Rsh}
R273 N038 N028 {Rs}
I137 N025 N021 {Iph}
D274 N021 N025 diffusion
D275 N021 N025 recombination
C137 N021 N025 {Cp}
R274 N021 N025 {Rsh}
R275 N021 N009 {Rs}
I138 N010 N027 {Iph}
D276 N027 N010 diffusion
D277 N027 N010 recombination
C138 N027 N010 {Cp}
R276 N027 N010 {Rsh}
R277 N027 N026 {Rs}
I139 N013 N030 {Iph}
D278 N030 N013 diffusion
D279 N030 N013 recombination
C139 N030 N013 {Cp}
R278 N030 N013 {Rsh}
R279 N030 N029 {Rs}
I140 N028 N022 {Iph}
D280 N022 N028 diffusion
D281 N022 N028 recombination
C140 N022 N028 {Cp}
R280 N022 N028 {Rsh}
R281 N022 N012 {Rs}
I141 N009 N001 {Iph}
D282 N001 N009 diffusion
D283 N001 N009 recombination
C141 N001 N009 {Cp}
R282 N001 N009 {Rsh}
R283 N001 N002 {Rs}
I142 N002 N011 {Iph}
D284 N011 N002 diffusion
D285 N011 N002 recombination
C142 N011 N002 {Cp}
R284 N011 N002 {Rsh}
R285 N011 N010 {Rs}
I143 N004 N014 {Iph}
D286 N014 N004 diffusion
D287 N014 N004 recombination
C143 N014 N004 {Cp}
R286 N014 N004 {Rsh}
R287 N014 N013 {Rs}
I144 N012 N003 {Iph}
D288 N003 N012 diffusion
D289 N003 N012 recombination
C144 N003 N012 {Cp}
R288 N003 N012 {Rsh}
R289 N003 N004 {Rs}
D290 0 N291 diodebp
L1 N281 0 {LConductor}
R290 N284 N291 {RConductor}
R291 OUT 0 100
C145 OUT 0 1p
.model D D
.lib standard.dio
.model NMOS NMOS
.model PMOS PMOS
.lib standard.mos
.model diffusion D IS=7.9406e-11 N=1
.model recombination D IS=5.0762e-6 N=2
.param Rs = 0.00171
.param Rsh = 59.23
.param Cp = 3.125u
.param Iph = 5.889
.param Ifail = 5.889
.model diodebp D
.param LConductor = 8.74u
.param RConductor = 44.21m
.model mos1 VDMOS(Ron=20m)
.tran 1m
.backanno
.end